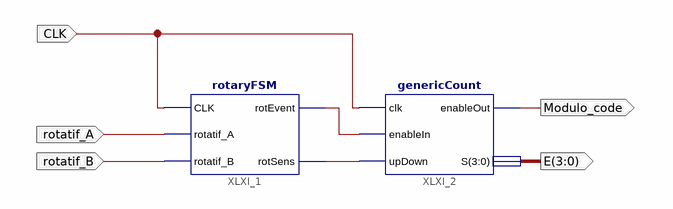
[diagram p0: schematic sheet 1]
// Xilinx ISE schematic globalRotary.sch (spartan3e) as structural Verilog: 2 symbols, 5 ports
module globalRotary (
  input  CLK,
  input  rotatif_A,
  input  rotatif_B,
  output Modulo_code,
  output [3:0] E
);

  wire XLXN_6, XLXN_7;

  rotaryFSM XLXI_1 (.CLK(CLK), .rotatif_A(rotatif_A), .rotatif_B(rotatif_B), .rotEvent(XLXN_6), .rotSens(XLXN_7));
  genericCount XLXI_2 (.clk(CLK), .enableIn(XLXN_6), .upDown(XLXN_7), .enableOut(Modulo_code), .S(E));
endmodule
